# Altium schematic sheet RTC_TEMP.SchDoc
size A4; SheetNumber: 8; SheetTotal: 10
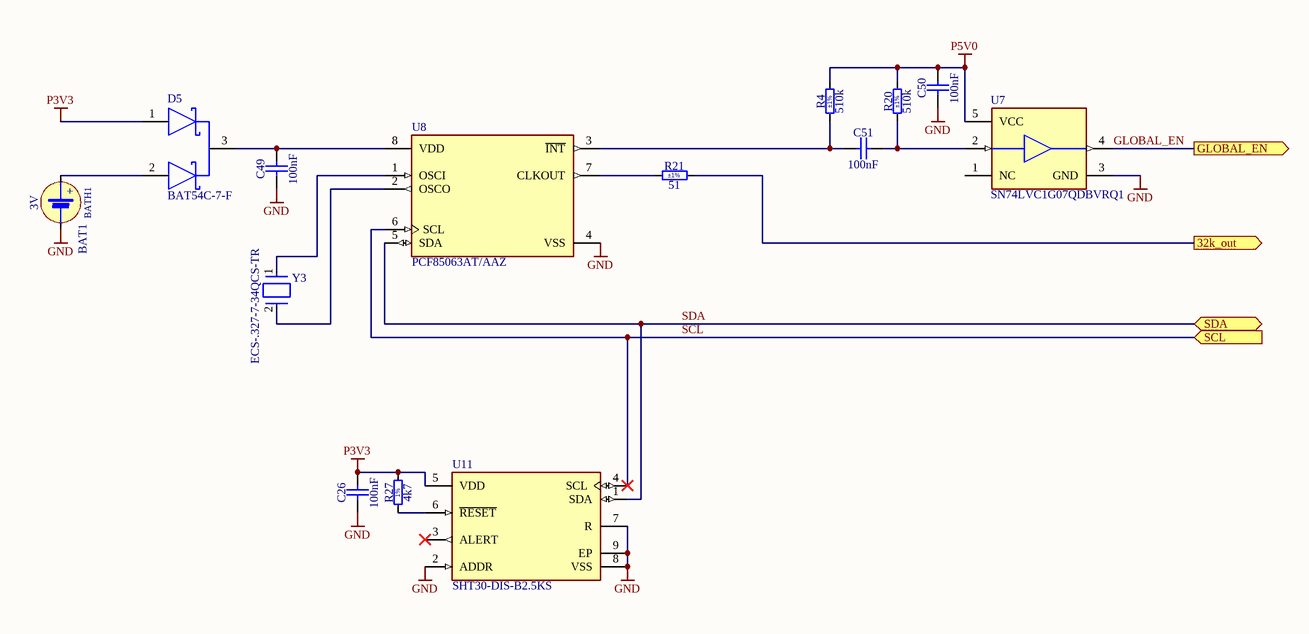
[diagram p0: RTC_TEMP.SchDoc]

## Parts
BAT1  3V  [BAT_VARTA_CR1220]
BATH1  (no value)  [BATH_KEYSTONE_3000]
C26  100nF  [CAPC1005X55N]
C49  100nF  [CAPC1005X55N]
C50  100nF  [CAPC1005X55N]
C51  100nF  [CAPC1005X55N]
D5  BAT54C-7-F  [FP-SOT23-IPC_A]
R4  510k  Tolerance: ±1%  [RESC1005X40N]
R20  510k  Tolerance: ±1%  [RESC1005X40N]
R21  51  Tolerance: ±1%  [RESC1005X40N]
R27  4k7  [RESC1005X40N]
U7  SN74LVC1G07QDBVRQ1  [FP-DBV0005A-IPC_A]
U8  PCF85063AT/AAZ  [FP-SOT96-1-MFG]
U11  SHT30-DIS-B2.5KS  [FP-SHT30-DIS-B2_5KS-MFG]
Y3  ECS-.327-7-34QCS-TR  [FP-ECX-34Q-0]

## Ports
32k_out (out), GLOBAL_EN (out), SCL (in), SDA (bidir)

## Nets
GND: BATH1.2(MINUS) C26.1 C49.1 C50.1 U7.3(GND) U8.4(VSS) U11.2(ADDR) U11.7(R) U11.8(VSS) U11.9(EP)
P3V3: C26.2 D5.1(1_ANODE) R27.2 U11.5(VDD)
P5V0: C50.2 R4.2 R20.2 U7.5(VCC)
32k_out: R21.2 ; port 32k_out
GLOBAL_EN: U7.4(Y) ; port GLOBAL_EN
SCL: U8.6(SCL) U11.4(SCL) ; port SCL
SDA: U8.5(SDA) U11.1(SDA) ; port SDA
NetBATH1_1: BATH1.1(PLUS) D5.2(2_ANODE)
NetC49_2: C49.2 D5.3(COMMON_CATHODE) U8.8(VDD)
NetC51_1: C51.1 R4.1 U8.3(~{INT})
NetC51_2: C51.2 R20.1 U7.2(A)
NetR21_1: R21.1 U8.7(CLKOUT)
NetR27_1: R27.1 U11.6(~{RESET})
NetU8_1: U8.1(OSCI) Y3.1(In/Out)
NetU8_2: U8.2(OSCO) Y3.2(Out/In)

Not connected (* = marked no-connect by the designer): U7 1(NC); U11 3(ALERT)*

## Notes on the sheet
- (in symbol BAT_VARTA_CR1220) +
- (in symbol BATH_KEYSTONE_3000) +
- (in symbol R0402_4K7_1%_0.0625W_100PPM) 1%

## Library data of the parts
BAT1 = BAT_VARTA_CR1220: Battery for use only with Socket Holder; Part Description: CR1210, 12.5mm Diameter x 2mm  Height Lithium Coin Cells; Manufacturer: VARTA; Manufacturer Part Number: 6220; PressFit: No; Power: 35mAh; Part Number: BAT_VARTA_CR1220; Component Kind: Accessories; Component Type: Standard; Pin Count: 0; PackageDescription: CR1210, 12.5mm Diameter x 2mm  Height Lithium Coin Cells; Family: Battery; Mounted: Yes; Socket: Yes; SMD: No; Sense: No; Value: 3V; ComponentHeight: 2mm; HelpURL: \\cern.ch\dfs\Applications\Altium\Datasheets\BAT_VARTA_CR1220.pdf; Author: CERN DEM JLC; CreateDate: 17.04.2012; LatestRevisionDate: 17.04.2012
BATH1 = BATH_KEYSTONE_3000: Battery Holder whit 2 Pin; Part Description: SMD Battery Holder for CR1216, BR1220, CL1225, SR1120, D381, 391, 191 Coin Cells; Manufacturer Part Number: 3000; PressFit: No; Part Number: BATH_KEYSTONE_3000; Component Kind: Standard; Component Type: Standard; Pin Count: 3; PackageDescription: SMD Battery Holder for CR1216, BR1220, CL1225, SR1120, D381, 391, 191 Coin Cells; Family: Battery; Mounted: Yes; Socket: No; SMD: Yes; Sense: No; Manufacturer: KEYSTONE; ComponentHeight: 3.17mm; HelpURL: \\cern.ch\dfs\Applications\Altium\Datasheets\BATH_KEYSTONE_3000.pdf; Author: CERN DEM JLC; CreateDate: 17.04.2012; LatestRevisionDate: 07.06.2017
C26 C49-C51 = CC0402_100NF_16V_10%_X5R: Non-polarised capacitor; Manufacturer: GENERIC; Part Description: SMD Multilayer Chip Ceramic Capacitor; Manufacturer1 Part Number: GRM155R61C104KA88D; Tolerance: ±10%; Voltage: 16V; TC: X5R; Manufacturer Part Number: CC0402_100NF_16V_10%_X5R; Part Number: CC0402_100NF_16V_10%_X5R; Value: 100nF; Component Kind: Standard; Component Type: Standard; Pin Count: 2; Status: None; Case: 0402; Mounted: Yes; Socket: No; SMD: Yes; Sense: No; Manufacturer1 Example: MURATA; Manufacturer1 ComponentHeight: 0.55mm; HelpURL: \\cern.ch\dfs\Applications\Altium\Datasheets\CC0402_X5R_MURATA_GRM.pdf; Author: CERN DEM JLC; CreateDate: 10.12.2013; LatestRevisionDate: 10.12.2013
D5 = CMP-12790-000084-1: DIODE ARRAY SCHOTTKY 30V SOT23-3; Max Reverse Current: 2uA; Power Dissipation: 200mW; Average Rectified Current: 200mA; Capacitance: 10pF; Peak Non-Repetitive Surge Current: 600mA; Forward Voltage: 800mV; Reverse Recovery Time: 5ns; Element Configuration: Common Cathode; Max Operating Temperature: 150°C; Max Reverse Voltage (DC): 30V; Power Rating: 200mW; Termination: SMD/SMT; REACH SVHC: No SVHC; Voltage Rating (DC): 30V; Series: -; Current Rating: 200mA; RoHS Compliant: Yes; Max Power Dissipation: 200mW; Case/Package: SOT-23; Max Repetitive Reverse Voltage (Vrrm): 30V; Width: 1.3mm; Min Operating Temperature: -65°C; Lead Free: Lead Free; Forward Current: 200mA; Number of Pins: 3; Contact Plating: Tin; Package Quantity: 3000; Length: 2.9mm; Radiation Hardening: No; Max Forward Surge Current (Ifsm): 600mA; Height: 1mm; Packaging: Tape and Reel; Mount: Surface Mount; Weight: 0.000282oz
R4 R20 = R0402_510K_1%_0.0625W_100PPM: Resistor - 1%; Part Description: General Purpose Thick Film Chip Resistor; Manufacturer: GENERIC; Manufacturer1 Part Number: 232270675104L; TC: ±100ppm/°C; PressFit: No; Part Number: R0402_510K_1%_0.0625W_100PPM; Component Kind: Standard; Component Type: Standard; Pin Count: 2; Value: 510k; Status: Not Recommended; Power: 0.0625W; Manufacturer Part Number: R0402_510K_1%_0.0625W_100PPM; Case: 0402; Mounted: Yes; Sense: No; Socket: No; SMD: Yes; Manufacturer1 Example: YAGEO PHYCOMP; Manufacturer1 ComponentHeight: 0.4mm; HelpURL: \\cern.ch\dfs\Applications\Altium\Datasheets\R0402_Phycomp_RC0402.pdf; Author: CERN DEM JLC; CreateDate: 03.12.2007; LatestRevisionDate: 17.10.2012
R21 = R0402_51R_1%_0.0625W_100PPM: Resistor - 1%; Part Description: General Purpose Thick Film Chip Resistor; Manufacturer: GENERIC; Manufacturer1 Part Number: 232270675109L; TC: ±100ppm/°C; PressFit: No; Part Number: R0402_51R_1%_0.0625W_100PPM; Component Kind: Standard; Component Type: Standard; Pin Count: 2; Value: 51; Status: Not Recommended; Power: 0.0625W; Manufacturer Part Number: R0402_51R_1%_0.0625W_100PPM; Case: 0402; Mounted: Yes; Sense: No; Socket: No; SMD: Yes; Manufacturer1 Example: YAGEO PHYCOMP; Manufacturer1 ComponentHeight: 0.4mm; HelpURL: \\cern.ch\dfs\Applications\Altium\Datasheets\R0402_Phycomp_RC0402.pdf; Author: CERN DEM JLC; CreateDate: 03.12.2007; LatestRevisionDate: 17.10.2012
R27 = R0402_4K7_1%_0.0625W_100PPM: Resistor - 1%; Part Description: General Purpose Thick Film Chip Resistor; Manufacturer: GENERIC; Manufacturer1 Part Number: 232270674702L; TC: ±100ppm/°C; PressFit: No; Part Number: R0402_4K7_1%_0.0625W_100PPM; Component Kind: Standard; Component Type: Standard; Pin Count: 2; Value: 4k7; Status: Not Recommended; Power: 0.0625W; Tolerance: ±1%; Manufacturer Part Number: R0402_4K7_1%_0.0625W_100PPM; Case: 0402; Mounted: Yes; Sense: No; Socket: No; SMD: Yes; Manufacturer1 Example: YAGEO PHYCOMP; Manufacturer1 ComponentHeight: 0.4mm; HelpURL: \\cern.ch\dfs\Applications\Altium\Datasheets\R0402_Phycomp_RC0402.pdf; Author: CERN DEM JLC; CreateDate: 03.12.2007; LatestRevisionDate: 17.10.2012
U7 = CMP-0859-00130-4: IC BUF NON-INVERT 5.5V SOT23-5; Quiescent Current: 10uA; Number of Channels: 1; Low Level Output Current: 32mA; Logic Function: Buffer; Turn-On Delay Time: 9.8ns; Polarity: Non-Inverting; Min Supply Voltage: 1.65V; Max Operating Temperature: 125°C; Number of Inputs: 1; Lead Free: Lead Free; Max Supply Voltage: 5.5V; Packaging: Tape and Reel; RoHS Compliant: Yes; Number of Pins: 5; Number of Input Lines: 1; Number of Outputs: 1; Technology: CMOS; Number of Bits: 1; Number of Gates: 1; Case/Package: SOT-23-5; Propagation Delay: 9.8ns; Series: 74LVC; Number of Elements: 1; Package Quantity: 3000; Number of Bits per Element: 1; Mount: Surface Mount; Number of Output Lines: 1; Min Operating Temperature: -40°C
U8 = CMP-10083-000015-1: IC RTC CLK/CALENDAR I2C 8SOIC; Date Format: YY-MM-DD-dd; Time Format: HH:MM:SS (12/24 hr); RoHS Compliant: Yes; Interface: I2C; Mount: Surface Mount; Min Operating Temperature: -40°C; Lead Free: Lead Free; Packaging: Tape and Reel; Max Operating Temperature: 85°C; Case/Package: SOIC
U11 = CMP-144040-000006-1: SENSOR HUMID/TEMP 5V I2C 3% SMD
Y3 = CMP-40224-000009-1: CRYSTAL 32.768KHZ 7PF SMD; Manufacturer: ECS Inc.; Tolerance: 10ppm; Automotive Grade: Grade 1; Esr: 70kΩ; Height: 0.9mm; Automotive: Yes; Lead Free: Yes; Temperature Range Low: -40°C; Load Capacitance: 7pF; Series: ECX-34Q; Temperature Range High: +125°C; Device Class L3: Crystals; Temperature: -40°C to +125°C; RoHS: TRUE; Category: Crys; ComponentLink2Description: Datasheet; Package: ECX-34Q; Frequency: 32.768kHz; Octopart: https://octopart.com/ecs-.327-7-34qcs-tr-ecs+international-74206377; Device Class L2: Crystals / Oscillators; Manufacturer Part Number: ECS-.327-7-34QCS-TR; Digikey Description: CRYSTAL 32.768KHZ 7PF SMD; Device Class L1: Passive Components; ComponentLink2URL: https://ecsxtal.com/store/pdf/ECX-34Q.pdf